# EAGLE design counter_defender_mk_2 (EAGLE 6.5.0)
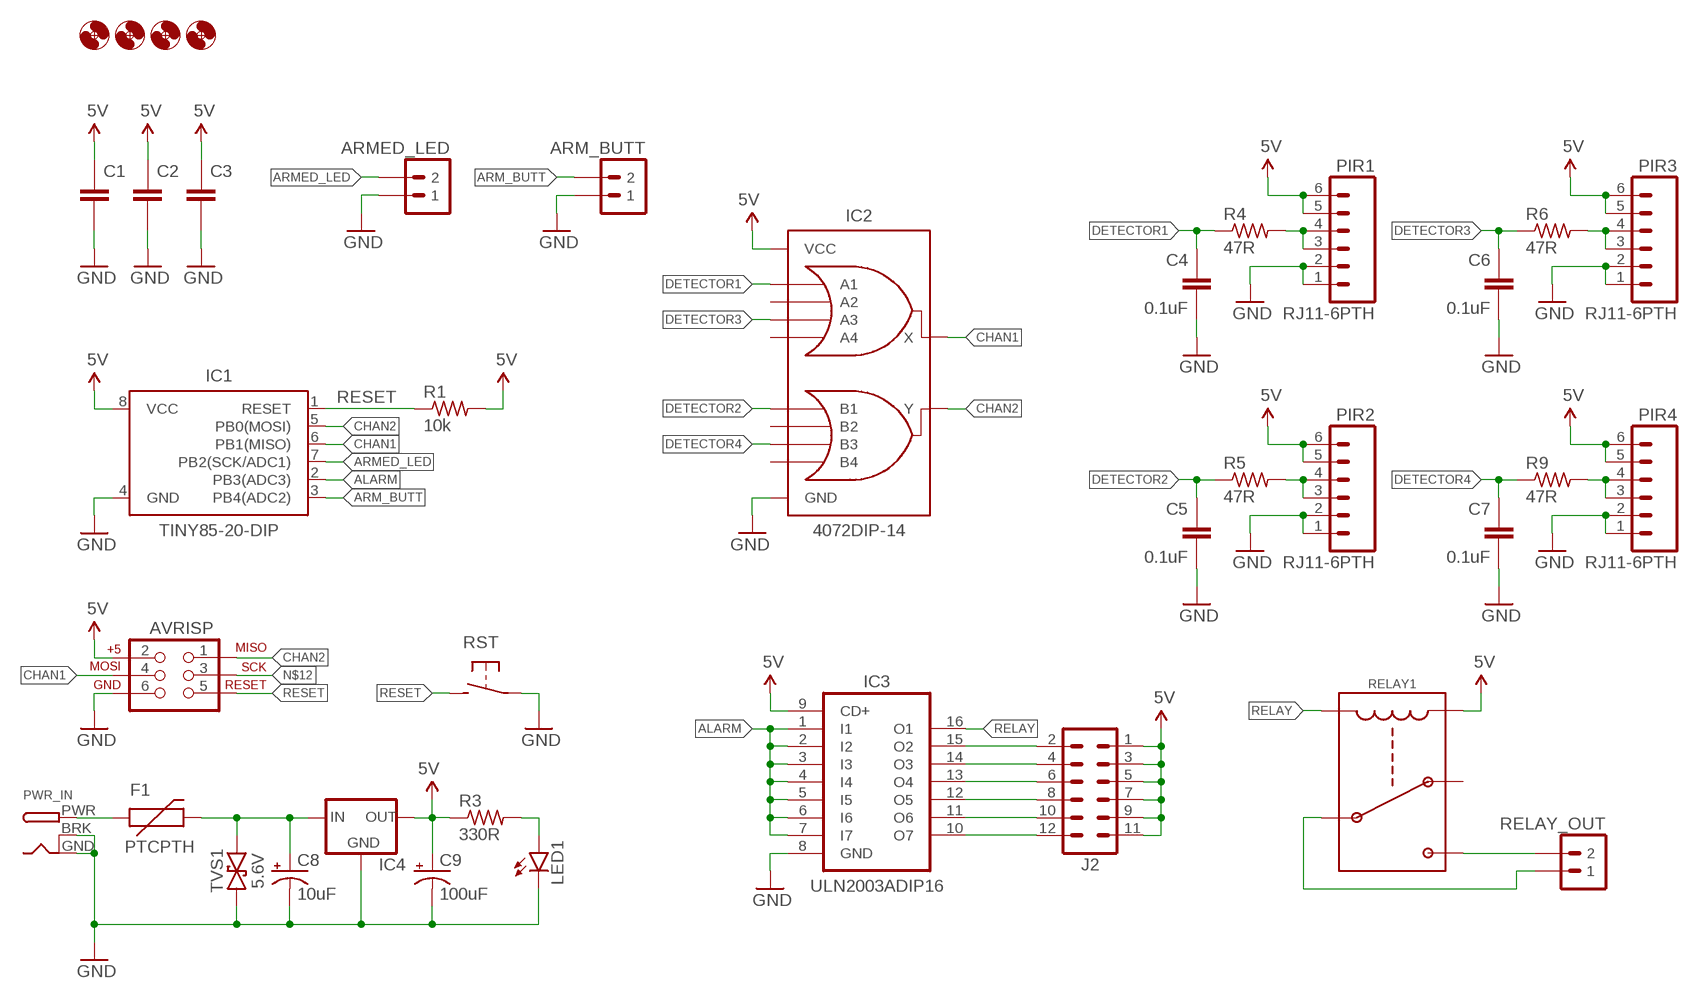
[diagram p0: schematic, sheet 1]

## Parts
ARM_BUTT  M02JST-PTH-VERT  [JST-2-PH-VERT-PTH]
ARMED_LED  M02JST-PTH-VERT  [JST-2-PH-VERT-PTH]
AVRISP  AVR_SPI_PRG_6PTH  [2X3]
C1  CAPACITOR-CERAMIC025-024X044  [C025-024X044]
C2  CAPACITOR-CERAMIC025-024X044  [C025-024X044]
C3  CAPACITOR-CERAMIC025-024X044  [C025-024X044]
C4  0.1uF  CAPACITOR-CERAMIC025-024X044  [C025-024X044]
C5  0.1uF  CAPACITOR-CERAMIC025-024X044  [C025-024X044]
C6  0.1uF  CAPACITOR-CERAMIC025-024X044  [C025-024X044]
C7  0.1uF  CAPACITOR-CERAMIC025-024X044  [C025-024X044]
C8  10uF  CAPACITOR-POLARIZEDE2-5  [E2-5]
C9  100uF  CAPACITOR-POLARIZEDE2.5-6  [E2,5-6]
F1  PTCPTH  [PTC]
H1  HOLE#2  [HOLE-#2]
H2  HOLE#2  [HOLE-#2]
H3  HOLE#2  [HOLE-#2]
H4  HOLE#2  [HOLE-#2]
IC1  TINY85-20-DIP  ATTINY45TINY85-20-DIP  [DIP08]
IC2  4072DIP-14  [DIL14]
IC3  ULN2003ADIP16  [DIL16]
IC4  L7805  V_REG_78XXTO-220-IGO-VERT  [TO220V]
J2  M06X2PTH  [2X6_PTH]
LED1  LED3MM  [LED3MM]
PIR1  RJ11-6PTH  [RJ11-6]
PIR2  RJ11-6PTH  [RJ11-6]
PIR3  RJ11-6PTH  [RJ11-6]
PIR4  RJ11-6PTH  [RJ11-6]
PWR_IN  DCBARRELPTH  [DCJACK_2MM_PTH]
R1  10k  RESISTORPTH-AXIAL-6.35MM  [RESISTOR-AXIAL-PTH-6.35MM]
R3  330R  RESISTORPTH-AXIAL-6.35MM  [RESISTOR-AXIAL-PTH-6.35MM]
R4  47R  RESISTORPTH-AXIAL-6.35MM  [RESISTOR-AXIAL-PTH-6.35MM]
R5  47R  RESISTORPTH-AXIAL-6.35MM  [RESISTOR-AXIAL-PTH-6.35MM]
R6  47R  RESISTORPTH-AXIAL-6.35MM  [RESISTOR-AXIAL-PTH-6.35MM]
R9  47R  RESISTORPTH-AXIAL-6.35MM  [RESISTOR-AXIAL-PTH-6.35MM]
RELAY1  RELAY-SPDTMC25120  [RELAY-SPDT-MC25120]
RELAY_OUT  M02SCREWTERM_2.54MM  [1X02_2.54_SCREWTERM]
RST  SPST-NO-TACT6MM-PTH  [DTS-6]
TVS1  5.6V  TVSDO-41-TVS-BIDIRECTIONAL  [DO-41-TVS]

## Nets
5V: AVRISP.2 C1.1 C2.1 C3.1 C9.+ IC1.8(VCC) IC2.14(VCC) IC3.9(CD+) IC4.3(OUT) J2.1 J2.3 J2.5 J2.7 J2.9 J2.11 PIR1.5 PIR1.6 PIR2.5 PIR2.6 PIR3.5 PIR3.6 PIR4.5 PIR4.6 R1.P$2 R3.P$1 RELAY1.CNTL2(C$1)
ALARM: IC1.2(PB3(ADC3)) IC3.1(I1) IC3.2(I2) IC3.3(I3) IC3.4(I4) IC3.5(I5) IC3.6(I6) IC3.7(I7)
ARM_BUTT: ARM_BUTT.2 IC1.3(PB4(ADC2))
ARMED_LED: ARMED_LED.2 IC1.7(PB2(SCK/ADC1))
CHAN1: AVRISP.4 IC1.6(PB1(MISO)) IC2.1(X)
CHAN2: AVRISP.1 IC1.5(PB0(MOSI)) IC2.13(Y)
DETECTOR1: C4.1 IC2.2(A1) R4.P$1
DETECTOR2: C5.1 IC2.9(B1) R5.P$1
DETECTOR3: C6.1 IC2.4(A3) R6.P$1
DETECTOR4: C7.1 IC2.11(B3) R9.P$1
GND: ARM_BUTT.1 ARMED_LED.1 AVRISP.6 C1.2 C2.2 C3.2 C4.2 C5.2 C6.2 C7.2 C8.- C9.- IC1.4(GND) IC2.7(GND) IC3.8(GND) IC4.2(GND) LED1.K(C) PIR1.1 PIR1.2 PIR2.1 PIR2.2 PIR3.1 PIR3.2 PIR4.1 PIR4.2 PWR_IN.BRK PWR_IN.GND RST.1 RST.2 TVS1.P$1
N$1: C8.+ F1.P$2 IC4.1(IN) TVS1.P$2
N$2: PIR1.3 PIR1.4 R4.P$2
N$3: PIR2.3 PIR2.4 R5.P$2
N$4: PIR3.3 PIR3.4 R6.P$2
N$5: PIR4.3 PIR4.4 R9.P$2
N$6: LED1.A R3.P$2
N$7: F1.P$1 PWR_IN.PWR
N$9: IC3.15(O2) J2.2
N$10: IC3.14(O3) J2.4
N$11: IC3.13(O4) J2.6
N$12: AVRISP.3
N$13: IC3.12(O5) J2.8
N$14: IC3.11(O6) J2.10
N$15: IC3.10(O7) J2.12
N$16: RELAY1.COM RELAY1.COM2(COM) RELAY_OUT.P1
N$17: RELAY1.NO RELAY_OUT.P2
RELAY: IC3.16(O1) RELAY1.CNTL1(C$2)
RESET: AVRISP.5 IC1.1(RESET) R1.P$1 RST.3 RST.4
Unconnected: IC2.3(A2) IC2.5(A4) IC2.10(B2) IC2.12(B4) RELAY1.NC

## Library data of the parts
ARM_BUTT ARMED_LED RELAY_OUT = A_butts:M02: Standard 2-pin 0.1" header. Use with - straight break away headers ( PRT-00116) - right angle break away headers (PRT-00553) - swiss pins (PRT-00743) - machine pins (PRT-00117) - female headers (PRT-00115) Molex polarized connector foot print use with: PRT-08233 with associated crimp pins and housings. 2.54_SCREWTERM for use with PRT-10571. 3.5mm Screw Terminal footprints for PRT-08084 5mm Screw Terminal footprints for use with PRT-08433
AVRISP = A_butts:AVR_SPI_PRG_6: AVR ISP 6 Pin This is the reduced ISP connector for AVR programming. Common on Arduino. This footprint will take up less PCB space and can be used with a 10-pin to 6-pin adapter such as SKU: BOB-08508 **Special note about "TEST_POINT" package. The stop mask is on the top side, so if you want your programming test points to be on the bottom of your board, make sure to place this package on the bottom side of the board. This also ensure that the orientation to program from the bottom side will be correct.
C1-C7 = A_butts:CAPACITOR-CERAMIC: CAPACITOR, European symbol
C8 C9 = A_butts:CAPACITOR-POLARIZED: POLARIZED CAPACITOR, American symbol
F1 = A_butts:PTC: Resettable Fuse PTC Resettable Fuse. Spark Fun Electronics SKU : COM-08357
H1-H4 = A_butts:HOLE: MOUNTING HOLE with drill center marker
IC1 = A_butts:ATTINY45: Atmel 8-pin 2/4/8kB flash uC; PROD_ID: IC-09445
IC2 = A_butts:4072
IC3 = A_butts:ULN2003A: DRIVER ARRAY
IC4 = A_butts:V_REG_78XX: Voltage Regulator Standard 7805 5V regulator. IGO (Input Ground Output). Spark Fun Electronics SKU : COM-00107
J2 = A_butts:M06X2
LED1 = A_butts:LED: LEDs Standard schematic elements and footprints for 5mm, 3mm, 1206, and 0603 sized LEDs. 5mm - Spark Fun Electronics SKU : COM-00529 (and others)
PIR1-PIR4 = A_butts:RJ11-6: RJ11 Jack Simple 6 pin RJ11 jack. Commonly found on CAT3 devices and Microchip programmers. SKU: PRT-00132
PWR_IN = A_butts:DCBARREL: 2.0mm DC Barrel Jack DCJACK_2MM_PTH - Through Hole Jack (4UConnector: 05537)
R1 R3-R6 R9 = A_butts:RESISTOR: RESISTOR, American symbol
RELAY1 = A_butts:RELAY-SPDT
RST = A_butts:SPST-NO-TACT
TVS1 = A_butts:TVS: Transient voltage suppressor- prevents ESD on inputs. Ignore package description- MBRA140 is NOT this type of part!!!

## Board
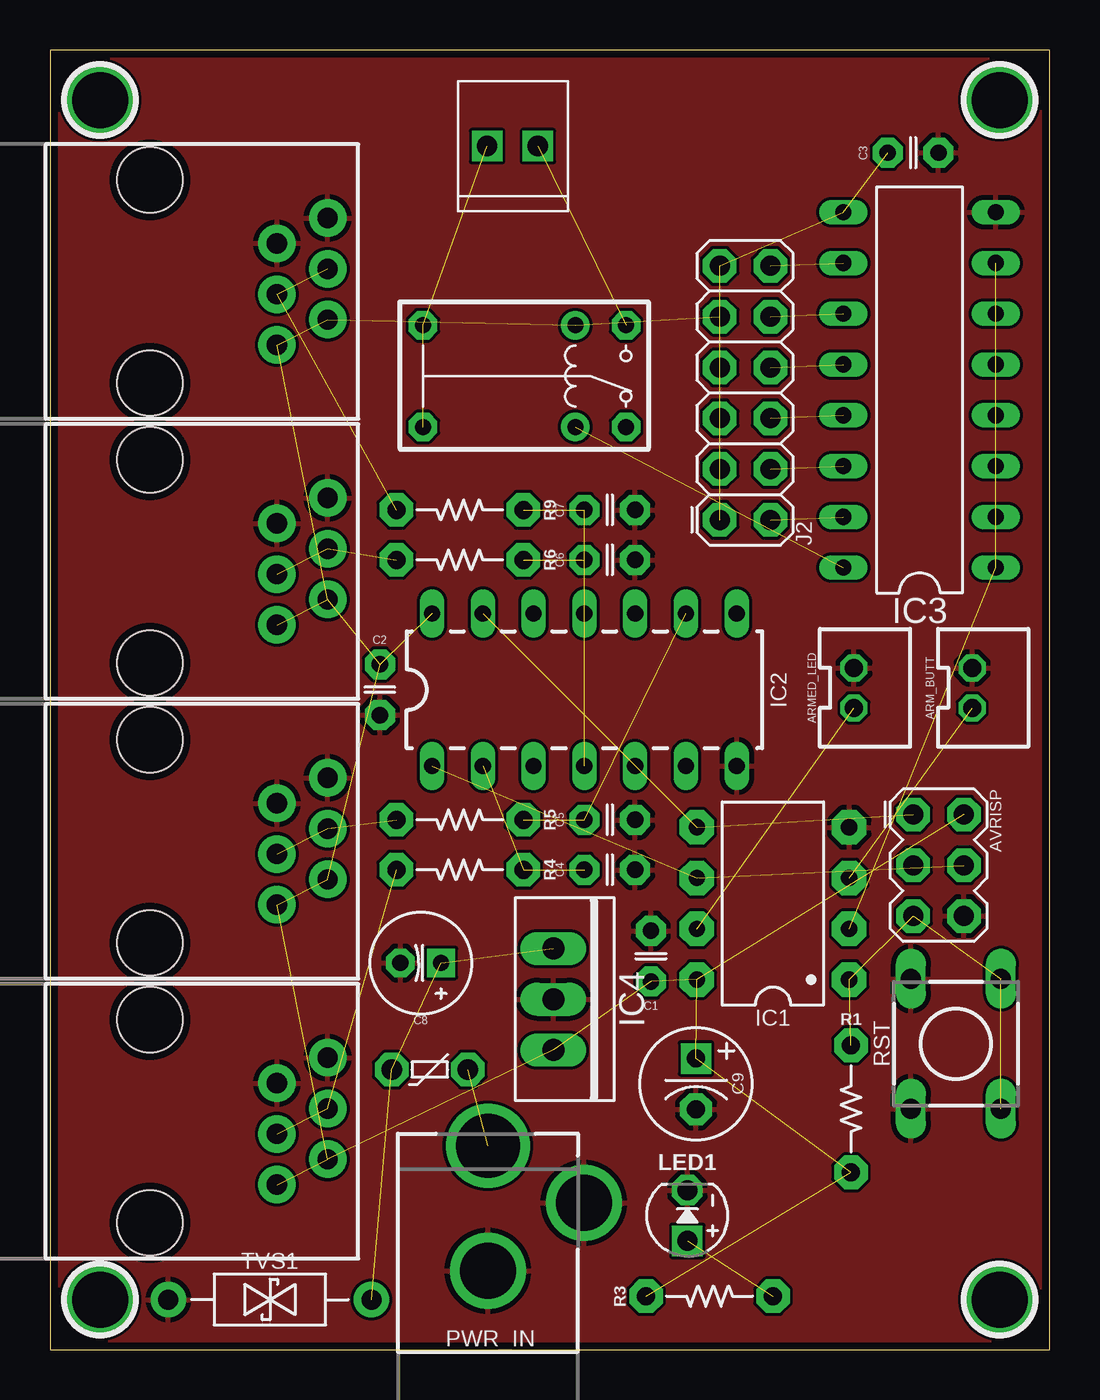
[diagram p1: board, top side]
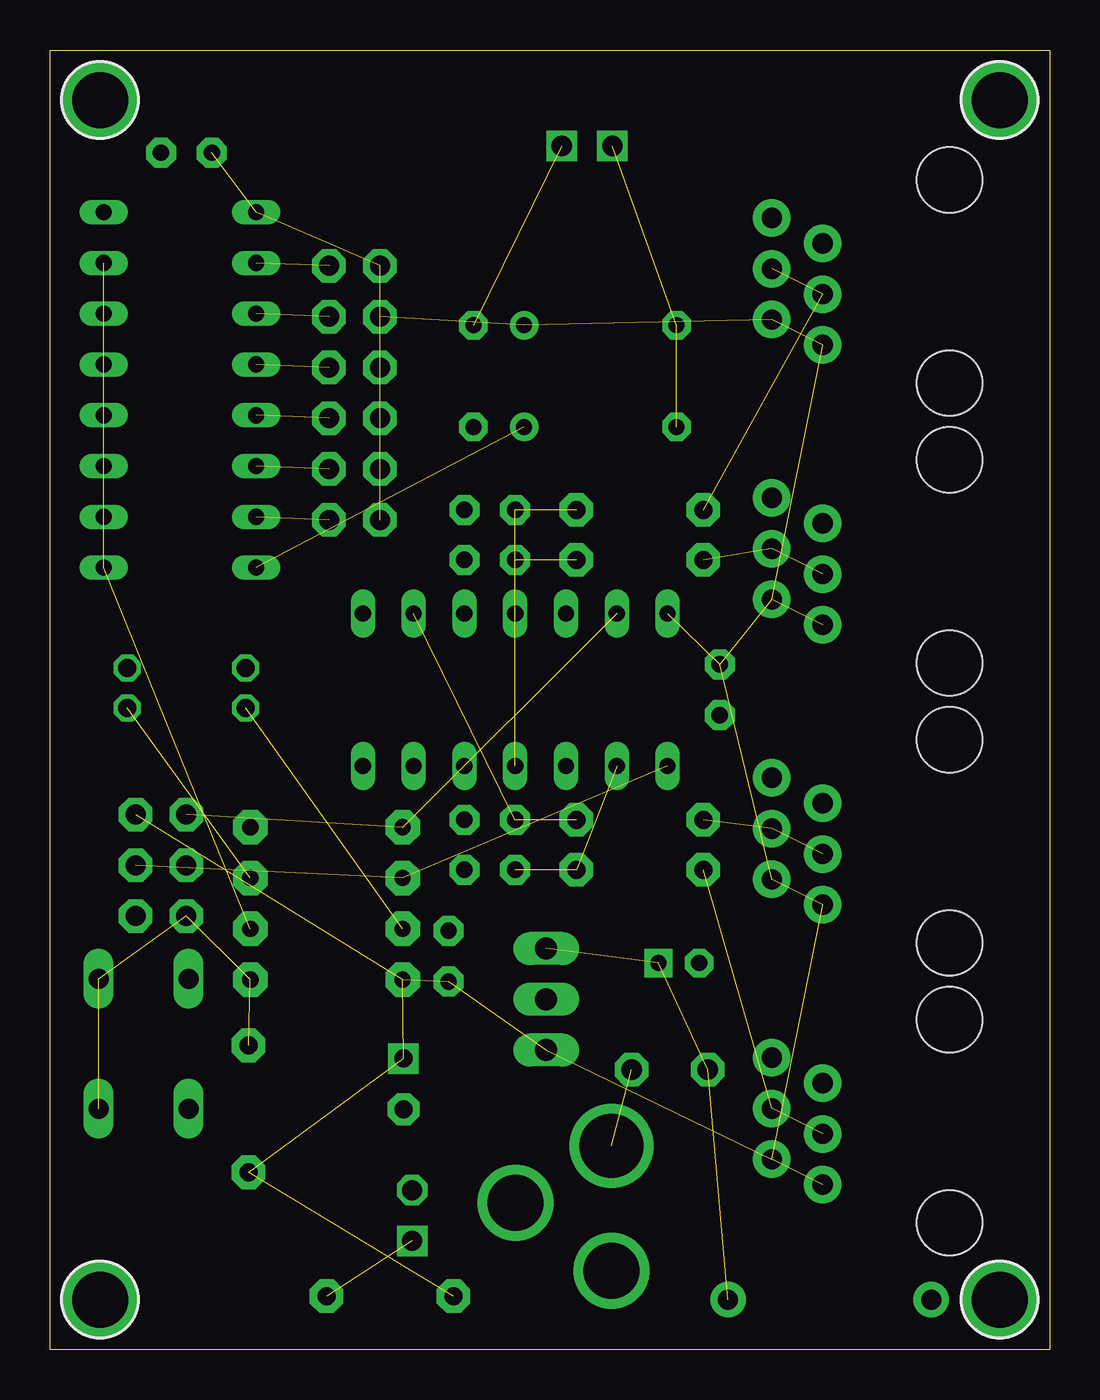
[diagram p2: board, bottom side, seen from below]

Size 50 x 65 mm. Coordinates in mm from the lower left corner, seen from the top.
Outline: 0,0 50,0 50,65 0,65 0,0
Copper layers (1*16): Top 0.0356mm / dielectric 1.5011mm / Bottom 0.0356mm
Design rules "LaenPCBOrder2": minimum track width 6mil, minimum drill 13mil, track to track 6mil, track to pad 6mil, pad to pad 6mil, via to via 6mil, smd to smd 6mil, copper to edge 15mil, drill to drill 6mil, minimum pad ring 7mil, minimum via ring 7mil, stop-mask expansion 3mil, vias tented up to drill 20mil, thermal gap 10mil

### Footprints (pad centres in the part's own frame; a part is rotated, then mirrored left to right if it is on the bottom)
JST-2-PH-VERT-PTH = drill 0.9 octagon: 1 -1,0; 2 1,0
2X3 = drill 1 pad 1.676 octagon: 1 -2.54,-1.27; 2 -2.54,1.27; 3 0,-1.27; 4 0,1.27; 5 2.54,-1.27; 6 2.54,1.27
C025-024X044 = drill 0.813 pad 1.5 octagon: 1 -1.27,0; 2 1.27,0
E2-5 = drill 0.813 pad 1.422 square: + -1.016,0 | drill 0.813 pad 1.422 octagon: - 1.016,0
E2,5-6 = drill 0.9 pad 1.524 square: + -1.27,0 | drill 0.9 pad 1.6 octagon: - 1.27,0
PTC = drill 1.016 pad 1.676 octagon: P$1 -1.905,0; P$2 1.905,0
HOLE-#2 = drill 2.8 pad 3.81: P$1 0,0
DIP08 = drill 0.813 pad 1.727 octagon: 1 -3.81,-3.81; 2 -1.27,-3.81; 3 1.27,-3.81; 4 3.81,-3.81; 5 3.81,3.81; 6 1.27,3.81; 7 -1.27,3.81; 8 -3.81,3.81
DIL14 = drill 0.813 long: 1 -8.89,-3.81; 2 -6.35,-3.81; 3 -3.81,-3.81; 4 -1.27,-3.81; 5 1.27,-3.81; 6 3.81,-3.81; 7 6.35,-3.81; 8 6.35,3.81; 9 3.81,3.81; 10 1.27,3.81; 11 -1.27,3.81; 12 -3.81,3.81; 13 -6.35,3.81; 14 -8.89,3.81
DIL16 = drill 0.813 long: 1 -8.89,-3.81; 2 -6.35,-3.81; 3 -3.81,-3.81; 4 -1.27,-3.81; 5 1.27,-3.81; 6 3.81,-3.81; 7 6.35,-3.81; 8 8.89,-3.81; 9 8.89,3.81; 10 6.35,3.81; 11 3.81,3.81; 12 1.27,3.81; 13 -1.27,3.81; 14 -3.81,3.81; 15 -6.35,3.81; 16 -8.89,3.81
TO220V = drill 1.1 long: 1 -2.54,0; 2 0,0; 3 2.54,0
2X6_PTH = drill 1 pad 1.676 octagon: 1 0,0; 2 0,-2.54; 3 2.54,0; 4 2.54,-2.54; 5 5.08,0; 6 5.08,-2.54; 7 7.62,0; 8 7.62,-2.54; 9 10.16,0; 10 10.16,-2.54; 11 12.7,0; 12 12.7,-2.54
LED3MM = drill 1 pad 1.524 square: A -1.27,0 | drill 1 pad 1.524 octagon: K 1.27,0
RJ11-6 = drill 1.016 pad 1.88: 1 1.905,8.89; 2 3.175,6.35; 3 4.445,8.89; 4 5.715,6.35; 5 6.985,8.89; 6 8.255,6.35 | hole 3.251: 0,0; 10.16,0
DCJACK_2MM_PTH = drill 2.8: BRK 4.8,10.75; GND 0,7.35 | drill 3.2: PWR 0,13.6
RESISTOR-AXIAL-PTH-6.35MM = drill 0.9 pad 1.676 octagon: P$1 -3.175,0; P$2 3.175,0
RELAY-SPDT-MC25120 = drill 0.8 pad 1.422: CNTL1 2.54,5.08; CNTL2 2.54,0 | drill 0.8 pad 1.422 octagon: COM 10.16,5.08; COM2 10.16,0; NC 0,5.08; NO 0,0
1X02_2.54_SCREWTERM = drill 1.016 square: P1 2.54,0; P2 0,0
DTS-6 = drill 1 long: 1 -3.25,2.25; 2 3.25,2.25; 3 -3.25,-2.25; 4 3.25,-2.25
DO-41-TVS = drill 1 pad 1.778: P$1 -5.08,0; P$2 5.08,0

### Placement (x,y rotation side)
ARM_BUTT  46.13,33.09 270 top
ARMED_LED  40.22,33.09 270 top
AVRISP  44.45,24.22 270 top
C1  30.06,19.68 90 top
C2  16.5,33 270 top
C3  43.18,59.86 0 top
C4  28,24 0 top
C5  28,26.5 0 top
C6  28,39.5 0 top
C7  28,42 0 top
C8  18.55,19.33 180 top
C9  32.32,13.29 270 top
F1  19,14 180 top
H1  2.5,2.5 0 top
H2  2.5,62.5 0 top
H3  47.5,2.5 0 top
H4  47.5,62.5 0 top
IC1  36.17,22.31 90 top
IC2  28,33 0 top
IC3  43.5,48 90 top
IC4  25.18,17.52 270 top
J2  33.5,41.5 90 top
LED1  31.89,6.7 90 top
PIR1  5,16.5 270 top
PIR2  5,30.5 270 top
PIR3  5,44.5 270 top
PIR4  5,58.5 270 top
PWR_IN  21.91,-3.41 0 top
R1  40.07,12.04 270 top
R3  32.99,2.67 0 top
R4  20.5,24 180 top
R5  20.5,26.5 180 top
R6  20.5,39.5 180 top
R9  20.5,42 180 top
RELAY1  28.82,51.23 180 top
RELAY_OUT  24.4,60.2 180 top
RST  45.32,15.3 90 top
TVS1  11,2.5 0 top

### Tracks (layer width: path | path; a pad name or v marks a point on that pad's centre or on a via)
5V  (25 unrouted)
ALARM  (7 unrouted)
ARM_BUTT  (1 unrouted)
ARMED_LED  (1 unrouted)
CHAN1  (2 unrouted)
CHAN2  (2 unrouted)
DETECTOR1  (2 unrouted)
DETECTOR2  (2 unrouted)
DETECTOR3  (2 unrouted)
DETECTOR4  (2 unrouted)
GND
  pour Top: 0,0 0,65 50,65 50,0
N$1  (3 unrouted)
N$2  (2 unrouted)
N$3  (2 unrouted)
N$4  (2 unrouted)
N$5  (2 unrouted)
N$6  (1 unrouted)
N$7  (1 unrouted)
N$9  (1 unrouted)
N$10  (1 unrouted)
N$11  (1 unrouted)
N$13  (1 unrouted)
N$14  (1 unrouted)
N$15  (1 unrouted)
N$16  (2 unrouted)
N$17  (1 unrouted)
RELAY  (1 unrouted)
RESET  (4 unrouted)